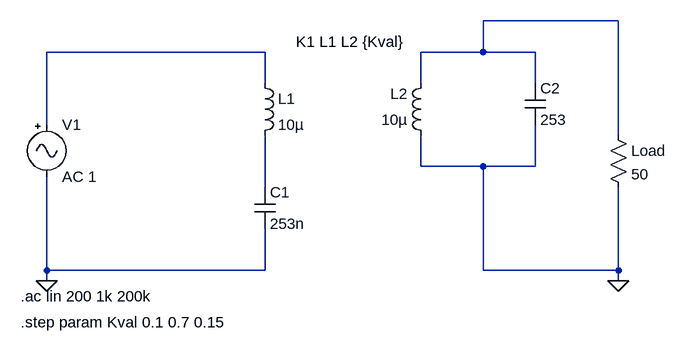
[diagram p0: schematic Resonant_wireless_power_transfer_link.asc]
Resonant_wireless_power_transfer_link.asc, the LTspice schematic file:
Version 4.1
SHEET 1 1024 680
WIRE 944 -32 736 -32
WIRE 400 16 64 16
WIRE 736 16 736 -32
WIRE 736 16 640 16
WIRE 816 16 736 16
WIRE 400 64 400 16
WIRE 640 64 640 16
WIRE 816 64 816 16
WIRE 64 128 64 16
WIRE 944 144 944 -32
WIRE 640 192 640 144
WIRE 736 192 640 192
WIRE 816 192 816 128
WIRE 816 192 736 192
WIRE 400 224 400 144
WIRE 64 352 64 208
WIRE 400 352 400 288
WIRE 400 352 64 352
WIRE 736 352 736 192
WIRE 944 352 944 224
WIRE 944 352 736 352
WIRE 64 368 64 352
WIRE 944 368 944 352
FLAG 64 368 0
FLAG 944 368 0
SYMBOL Misc\\signal 64 112 R0
WINDOW 123 0 0 Left 0
WINDOW 39 0 0 Left 0
SYMATTR InstName V1
SYMATTR Value AC 1
SYMBOL ind 384 48 R0
SYMATTR InstName L1
SYMATTR Value 10µ
SYMATTR Type ind
SYMATTR SpiceLine Rser=1m
SYMBOL cap 384 224 R0
SYMATTR InstName C1
SYMATTR Value 253n
SYMATTR SpiceLine Rser=1m
SYMBOL ind 656 160 R180
WINDOW 0 36 80 Left 2
WINDOW 3 36 40 Left 2
SYMATTR InstName L2
SYMATTR Value 10µ
SYMATTR Type ind
SYMATTR SpiceLine Rser=1m
SYMBOL cap 800 64 R0
SYMATTR InstName C2
SYMATTR Value 253
SYMATTR SpiceLine Rser=1m
SYMBOL res 928 128 R0
SYMATTR InstName Load
SYMATTR Value 50
TEXT 24 392 Left 2 !.ac lin 200 1k 200k
TEXT 448 0 Left 2 !K1 L1 L2 {Kval}
TEXT 24 432 Left 2 !.step param Kval 0.1 0.7 0.15

The netlist it stands for:
* Resonant_wireless_power_transfer_link.asc
V1 N002 0 AC 1
L1 N002 N003 10µ Rser=1m
C1 N003 0 253n Rser=1m
L2 0 N001 10µ Rser=1m
C2 N001 0 253 Rser=1m
R§Load N001 0 50
.ac lin 200 1k 200k
K1 L1 L2 {Kval}
.step param Kval 0.1 0.7 0.15
.backanno
.end